# EAGLE design FunctionGen (EAGLE 6.4)
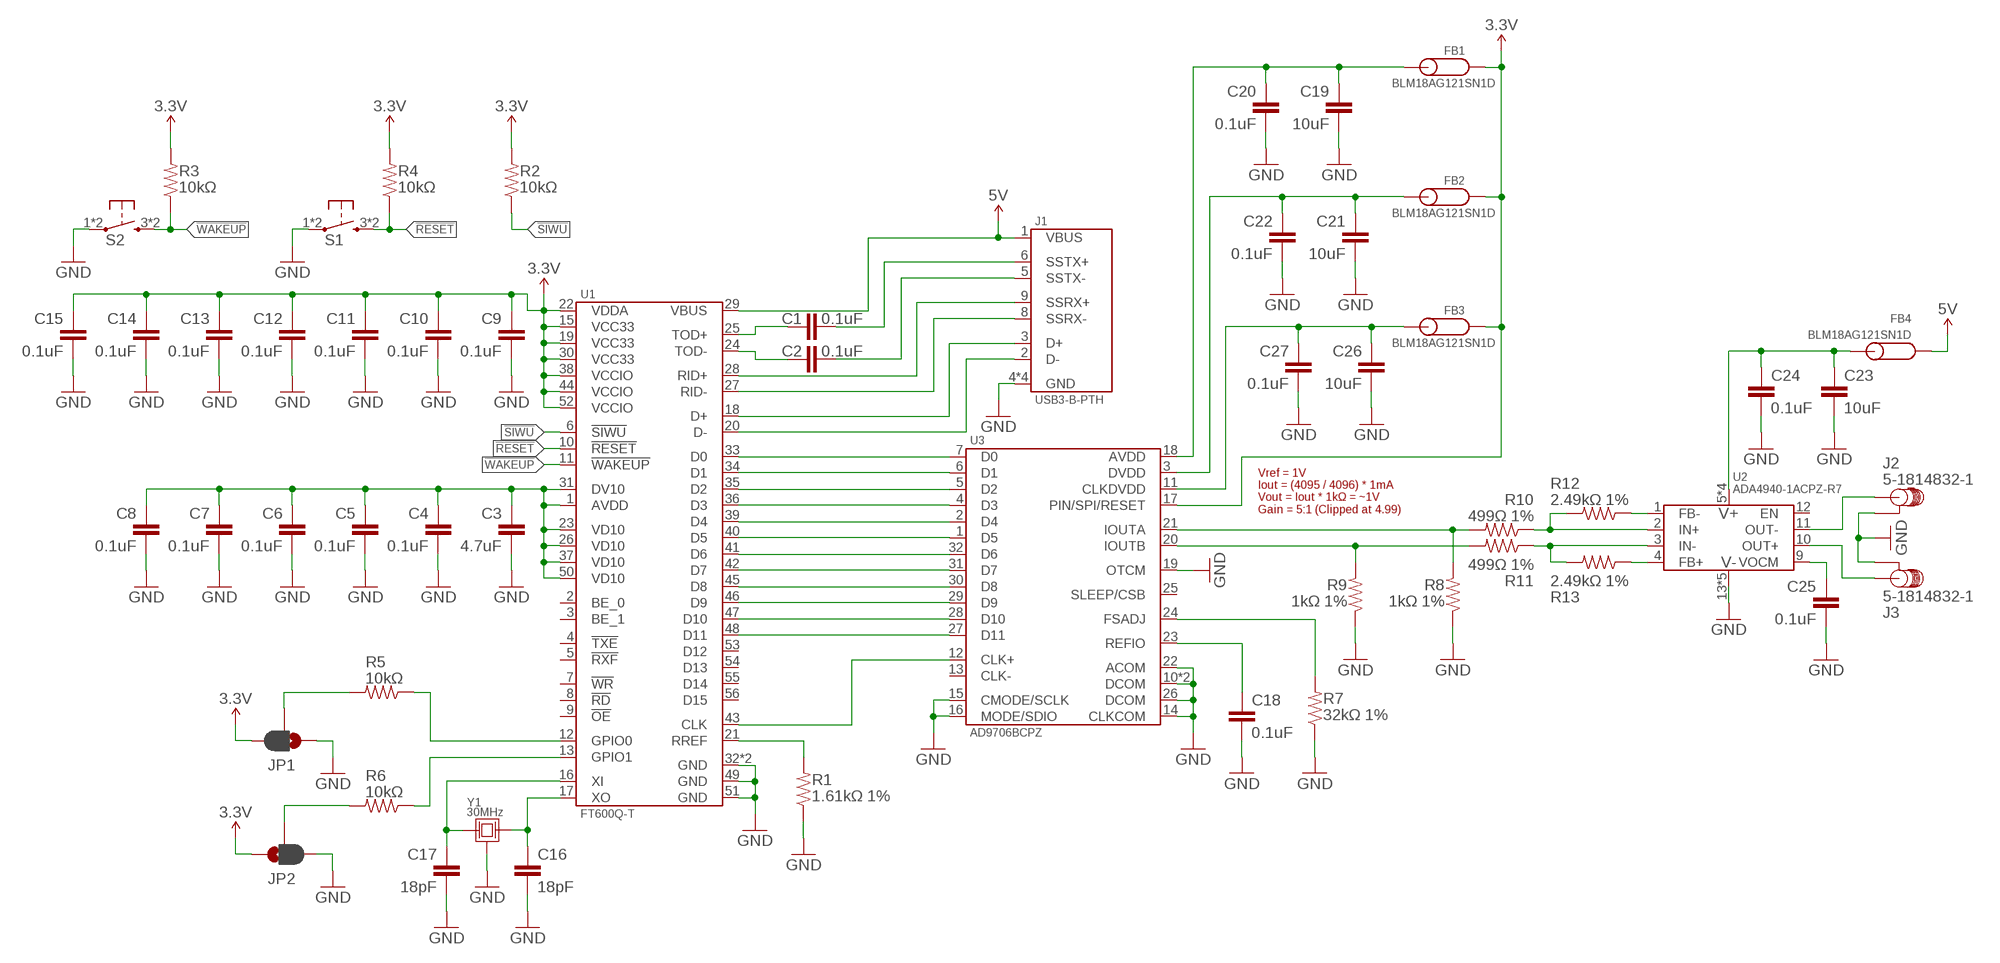
[diagram p0: schematic, sheet 1]

## Parts
C1  0.1uF  CAP-0603  [0603-CAP]
C2  0.1uF  CAP-0603  [0603-CAP]
C3  4.7uF  CAP-0603  [0603-CAP]
C4  0.1uF  CAP-0603  [0603-CAP]
C5  0.1uF  CAP-0603  [0603-CAP]
C6  0.1uF  CAP-0603  [0603-CAP]
C7  0.1uF  CAP-0603  [0603-CAP]
C8  0.1uF  CAP-0603  [0603-CAP]
C9  0.1uF  CAP-0603  [0603-CAP]
C10  0.1uF  CAP-0603  [0603-CAP]
C11  0.1uF  CAP-0603  [0603-CAP]
C12  0.1uF  CAP-0603  [0603-CAP]
C13  0.1uF  CAP-0603  [0603-CAP]
C14  0.1uF  CAP-0603  [0603-CAP]
C15  0.1uF  CAP-0603  [0603-CAP]
C16  18pF  CAP-0603  [0603-CAP]
C17  18pF  CAP-0603  [0603-CAP]
C18  0.1uF  CAP-0603  [0603-CAP]
C19  10uF  CAP-0603  [0603-CAP]
C20  0.1uF  CAP-0603  [0603-CAP]
C21  10uF  CAP-0603  [0603-CAP]
C22  0.1uF  CAP-0603  [0603-CAP]
C23  10uF  CAP-0603  [0603-CAP]
C24  0.1uF  CAP-0603  [0603-CAP]
C25  0.1uF  CAP-0603  [0603-CAP]
C26  10uF  CAP-0603  [0603-CAP]
C27  0.1uF  CAP-0603  [0603-CAP]
FB1  BLM18AG121SN1D  FERRITE-0603  [0603-FERRITE]
FB2  BLM18AG121SN1D  FERRITE-0603  [0603-FERRITE]
FB3  BLM18AG121SN1D  FERRITE-0603  [0603-FERRITE]
FB4  BLM18AG121SN1D  FERRITE-0603  [0603-FERRITE]
J1  USB3-B-PTH  [GSB4211311WEU]
J2  5-1814832-1  SMA-PTH  [SMA-PTH]
J3  5-1814832-1  SMA-PTH  [SMA-PTH]
JP1  JUMPER-PAD-3-2OF3_NC_BY_PASTE  [PAD-JUMPER-3-2OF3_NC_BY_PASTE_YES_SILK_FULL_BOX]
JP2  JUMPER-PAD-3-2OF3_NC_BY_PASTE  [PAD-JUMPER-3-2OF3_NC_BY_PASTE_YES_SILK_FULL_BOX]
R1  1.61kΩ 1%  RESISTOR-0603  [0603-CAP]
R2  10kΩ  RESISTOR-0603  [0603-CAP]
R3  10kΩ  RESISTOR-0603  [0603-CAP]
R4  10kΩ  RESISTOR-0603  [0603-CAP]
R5  10kΩ  RESISTOR-0603  [0603-CAP]
R6  10kΩ  RESISTOR-0603  [0603-CAP]
R7  32kΩ 1%  RESISTOR-0603  [0603-CAP]
R8  1kΩ 1%  RESISTOR-0603  [0603-CAP]
R9  1kΩ 1%  RESISTOR-0603  [0603-CAP]
R10  499Ω 1%  RESISTOR-0603  [0603-CAP]
R11  499Ω 1%  RESISTOR-0603  [0603-CAP]
R12  2.49kΩ 1%  RESISTOR-0603  [0603-CAP]
R13  2.49kΩ 1%  RESISTOR-0603  [0603-CAP]
S1  TACTILE-SMD3  [FSM4JSMA]
S2  TACTILE-SMD3  [FSM4JSMA]
U1  FT600Q-T  [VQFN-56-7MM]
U2  ADA4940-1ACPZ-R7  [VQFN-16-3MM]
U3  AD9706BCPZ  [VQFN-32-5MM]
Y1  30MHz  CRYSTAL-3.2X2.5  [FA-238]

## Nets
3.3V: C9.1 C10.1 C11.1 C12.1 C13.1 C14.1 C15.1 FB1.P$1 FB2.P$1 FB3.P$1 JP1.3 JP2.1 R2.2 R3.2 R4.2 U1.15(VCC33) U1.19(VCC33) U1.22(VDDA) U1.30(VCC33) U1.38(VCCIO) U1.44(VCCIO) U1.52(VCCIO) U3.17(PIN/SPI/RESET)
5V: FB4.P$1 J1.1(VBUS) U1.29(VBUS)
!RESET: R4.1 S1.3 S1.4 U1.10(!RESET)
!SIWU: R2.1 U1.6(!SIWU)
!WAKEUP: R3.1 S2.3 S2.4 U1.11(!WAKEUP)
_T_N: C2.1 U1.24(TOD-)
_T_P: C1.1 U1.25(TOD+)
CLK: U1.43(CLK) U3.12(CLK+)
D0: U1.33(D0) U3.7(D0)
D1: U1.34(D1) U3.6(D1)
D2: U1.35(D2) U3.5(D2)
D3: U1.36(D3) U3.4(D3)
D4: U1.39(D4) U3.2(D4)
D5: U1.40(D5) U3.1(D5)
D6: U1.41(D6) U3.32(D6)
D7: U1.42(D7) U3.31(D7)
D8: U1.45(D8) U3.30(D8)
D9: U1.46(D9) U3.29(D9)
D10: U1.47(D10) U3.28(D10)
D11: U1.48(D11) U3.27(D11)
D_N: J1.2(D-) U1.20(D-)
D_P: J1.3(D+) U1.18(D+)
GND: C3.2 C4.2 C5.2 C6.2 C7.2 C8.2 C9.2 C10.2 C11.2 C12.2 C13.2 C14.2 C15.2 C16.2 C17.2 C18.2 C19.2 C20.2 C21.2 C22.2 C23.2 C24.2 C25.2 C26.2 C27.2 J1.4(GND) J1.7(GND) J1.P$10(GND) J1.P$11(GND) J2.P$1(GND) J2.P$2(GND) J2.P$3(GND) J2.P$4(GND) J3.P$1(GND) J3.P$2(GND) J3.P$3(GND) J3.P$4(GND) JP1.1 JP2.3 R1.1 R7.1 R8.1 R9.1 S1.1 S1.2 S2.1 S2.2 U1.32(GND) U1.49(GND) U1.51(GND) U1.PAD(GND) U2.13(VS-) U2.14(VS-) U2.15(VS-) U2.16(VS-) U2.PAD(VS-) U3.10(DCOM) U3.14(CLKCOM) U3.15(CMODE/SCLK) U3.16(MODE/SDIO) U3.19(OTCM) U3.22(ACOM) U3.26(DCOM) U3.PAD(DCOM) Y1.2(GND) Y1.4(GND)
GPIO0: R5.1 U1.12(GPIO0)
GPIO1: R6.1 U1.13(GPIO1)
N$1: C3.1 C4.1 C5.1 C6.1 C7.1 C8.1 U1.1(AVDD) U1.23(VD10) U1.26(VD10) U1.31(DV10) U1.37(VD10) U1.50(VD10)
N$2: R1.2 U1.21(RREF)
N$3: C17.1 U1.16(XI) Y1.1
N$4: C16.1 U1.17(XO) Y1.3
N$5: JP1.2 R5.2
N$6: JP2.2 R6.2
N$22: C18.1 U3.23(REFIO)
N$23: R7.2 U3.24(FSADJ)
N$24: C19.1 C20.1 FB1.P$2 U3.18(AVDD)
N$25: C21.1 C22.1 FB2.P$2 U3.3(DVDD)
N$26: C26.1 C27.1 FB3.P$2 U3.11(CLKDVDD)
N$27: C23.1 C24.1 FB4.P$2 U2.5(VS+) U2.6(VS+) U2.7(VS+) U2.8(VS+)
N$28: C25.1 U2.9(VOCM)
N$29: R13.1 U2.4(FB+)
N$30: R12.1 U2.1(FB-)
N$31: R10.1 R12.2 U2.2(IN+)
N$32: R11.1 R13.2 U2.3(IN-)
N$33: R9.2 R11.2 U3.20(IOUTB)
N$34: R8.2 R10.2 U3.21(IOUTA)
N$35: J3.SIGNAL U2.10(OUT+)
N$36: J2.SIGNAL U2.11(OUT-)
R_N: J1.8(SSRX-) U1.27(RID-)
R_P: J1.9(SSRX+) U1.28(RID+)
T_N: C2.2 J1.5(SSTX-)
T_P: C1.2 J1.6(SSTX+)
Unconnected: U1.2(BE_0) U1.3(BE_1) U1.4(!TXE) U1.5(!RXF) U1.7(!WR) U1.8(!RD) U1.9(!OE) U1.53(D12) U1.54(D13) U1.55(D14) U1.56(D15) U2.12(EN) U3.13(CLK-) U3.25(SLEEP/CSB)

## Notes on the sheet
- Vref = 1V
  Iout = (4095 / 4096) * 1mA
  Vout = Iout * 1kΩ = ~1V
  Gain = 5:1 (Clipped at 4.99)

## Library data of the parts
C1-C27 = Passives:CAP
FB1-FB4 = Passives:FERRITE
J1 = Connectors:USB3
J2 J3 = Connectors:SMA
JP1 JP2 = SparkFun-Passives:JUMPER-PAD-3-2OF3_NC_BY_PASTE
R1-R13 = Passives:RESISTOR
S1 S2 = Passives:TACTILE
U1 = FTDI:FT600
U2 = AnalogDevices:ADA4940
U3 = AnalogDevices:AD9706
Y1 = Passives:CRYSTAL

## Board
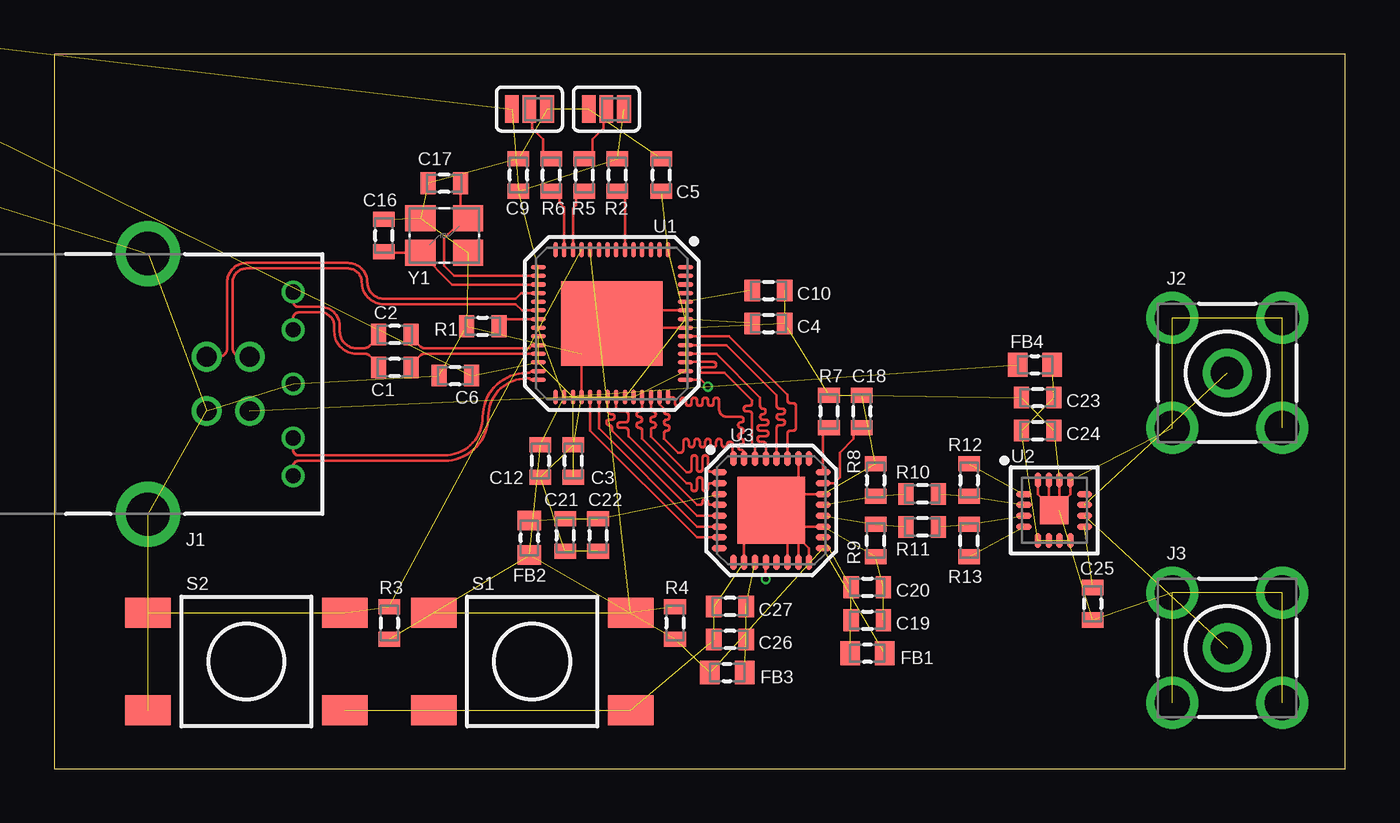
[diagram p1: board, top side]
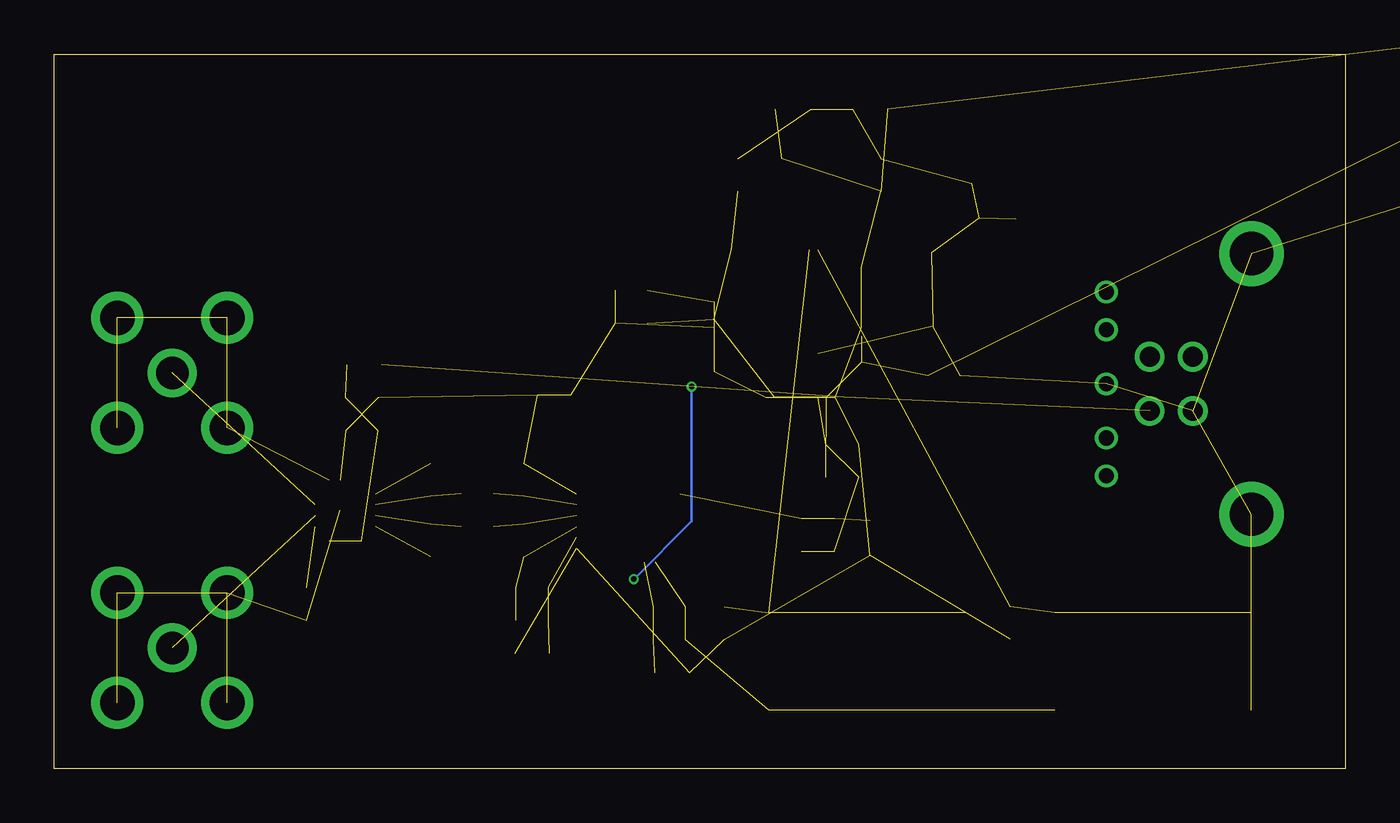
[diagram p2: board, bottom side, seen from below]

Size 59.69 x 33.02 mm. Coordinates in mm from the lower left corner, seen from the top.
Outline: 0,0 59.69,0 59.69,33.02 0,33.02 0,0
Copper layers (1*2*15*16): Top 0.035559375mm / dielectric 0.17018125mm / Route2 0.01778125mm / dielectric 47mil / Route15 0.01778125mm / dielectric 0.17018125mm / Bottom 0.035559375mm
Design rules "OSHPark-4layer *": minimum track width 5mil, minimum drill 10mil, track to track 5mil, track to pad 5mil, pad to pad 5mil, via to via 5mil, smd to smd 5mil, copper to edge 15mil, drill to drill 6mil, minimum pad ring 4mil, minimum via ring 4mil, stop-mask expansion 4mil, vias tented up to drill 20mil, thermal gap 10mil

### Footprints (pad centres in the part's own frame; a part is rotated, then mirrored left to right if it is on the bottom)
0603-CAP = smd 0.7 x 1: 1 -0.75,0; 2 0.75,0
0603-FERRITE = smd 0.9 x 1.1: P$1 -0.8,0; P$2 0.8,0
GSB4211311WEU = drill 0.92: 1 1.25,-2; 2 -1.25,-2; 3 -1.25,-4; 4 1.25,-4 | drill 0.7: 5 -4.25,0; 6 -2.5,0; 7 0,0; 8 2.5,0; 9 4.25,0 | drill 2: P$10 -6.02,-6.71; P$11 6.02,-6.71
SMA-PTH = drill 1.6: P$1 -2.54,2.54; P$2 -2.54,-2.54; P$3 2.54,-2.54; P$4 2.54,2.54 | drill 1.5: SIGNAL 0,0
PAD-JUMPER-3-2OF3_NC_BY_PASTE_YES_SILK_FULL_BOX = smd 0.635 x 1.27: 1 -0.813,0; 2 0,0; 3 0.813,0
FSM4JSMA = smd 2.1 x 1.4: 1 -4.55,-2.25; 2 4.55,-2.25; 3 -4.55,2.25; 4 4.55,2.25
VQFN-56-7MM = smd 0.7 x 0.2: 1 -3.4,2.6; 2 -3.4,2.2; 3 -3.4,1.8; 4 -3.4,1.4; 5 -3.4,1; 6 -3.4,0.6; 7 -3.4,0.2; 8 -3.4,-0.2; 9 -3.4,-0.6; 10 -3.4,-1; 11 -3.4,-1.4; 12 -3.4,-1.8; 13 -3.4,-2.2; 14 -3.4,-2.6; 29 3.4,-2.6; 30 3.4,-2.2; 31 3.4,-1.8; 32 3.4,-1.4; 33 3.4,-1; 34 3.4,-0.6; 35 3.4,-0.2; 36 3.4,0.2; 37 3.4,0.6; 38 3.4,1; 39 3.4,1.4; 40 3.4,1.8; 41 3.4,2.2; 42 3.4,2.6 | smd 0.2 x 0.7: 15 -2.6,-3.4; 16 -2.2,-3.4; 17 -1.8,-3.4; 18 -1.4,-3.4; 19 -1,-3.4; 20 -0.6,-3.4; 21 -0.2,-3.4; 22 0.2,-3.4; 23 0.6,-3.4; 24 1,-3.4; 25 1.4,-3.4; 26 1.8,-3.4; 27 2.2,-3.4; 28 2.6,-3.4; 43 2.6,3.4; 44 2.2,3.4; 45 1.8,3.4; 46 1.4,3.4; 47 1,3.4; 48 0.6,3.4; 49 0.2,3.4; 50 -0.2,3.4; 51 -0.6,3.4; 52 -1,3.4; 53 -1.4,3.4; 54 -1.8,3.4; 55 -2.2,3.4; 56 -2.6,3.4 | smd 3.9 x 4.7: PAD 0,0
VQFN-16-3MM = smd 0.7 x 0.3: 1 -1.4,0.75; 2 -1.4,0.25; 3 -1.4,-0.25; 4 -1.4,-0.75; 9 1.4,-0.75; 10 1.4,-0.25; 11 1.4,0.25; 12 1.4,0.75 | smd 0.3 x 0.7: 5 -0.75,-1.4; 6 -0.25,-1.4; 7 0.25,-1.4; 8 0.75,-1.4; 13 0.75,1.4; 14 0.25,1.4; 15 -0.25,1.4; 16 -0.75,1.4 | smd 1.3 x 1.3: PAD 0,0
VQFN-32-5MM = smd 0.7 x 0.3: 1 -2.4,1.75; 2 -2.4,1.25; 3 -2.4,0.75; 4 -2.4,0.25; 5 -2.4,-0.25; 6 -2.4,-0.75; 7 -2.4,-1.25; 8 -2.4,-1.75; 17 2.4,-1.75; 18 2.4,-1.25; 19 2.4,-0.75; 20 2.4,-0.25; 21 2.4,0.25; 22 2.4,0.75; 23 2.4,1.25; 24 2.4,1.75 | smd 0.3 x 0.7: 9 -1.75,-2.4; 10 -1.25,-2.4; 11 -0.75,-2.4; 12 -0.25,-2.4; 13 0.25,-2.4; 14 0.75,-2.4; 15 1.25,-2.4; 16 1.75,-2.4; 25 1.75,2.4; 26 1.25,2.4; 27 0.75,2.4; 28 0.25,2.4; 29 -0.25,2.4; 30 -0.75,2.4; 31 -1.25,2.4; 32 -1.75,2.4 | smd 3.1 x 3.1: PAD 0,0
FA-238 = smd 1.4 x 1.2: 1 -1.1,-0.8; 2 1.1,-0.8; 3 1.1,0.8; 4 -1.1,0.8

### Placement (x,y rotation side)
C1  15.75,18.54 180 top
C2  15.75,20.07 180 top
C3  24,14.22 90 top
C4  33.02,20.57 0 top
C5  28.07,27.43 90 top
C6  18.54,18.16 180 top
C7  -43.18,49.53 0 top  (outside the outline)
C8  -46.99,49.53 0 top  (outside the outline)
C9  21.46,27.43 90 top
C10  33.02,22.1 0 top
C11  -52.07,45.72 0 top  (outside the outline)
C12  22.48,14.22 270 top
C13  -41.91,38.1 0 top  (outside the outline)
C14  -46.99,38.1 0 top  (outside the outline)
C15  -52.07,38.1 0 top  (outside the outline)
C16  15.24,24.64 90 top
C17  18.03,27.05 180 top
C18  37.34,16.51 90 top
C19  37.59,6.86 0 top
C20  37.59,8.38 0 top
C21  23.62,10.79 270 top
C22  25.15,10.79 270 top
C23  45.47,17.14 180 top
C24  45.47,15.62 0 top
C25  48.01,7.62 270 top
C26  31.24,5.97 180 top
C27  31.24,7.49 180 top
FB1  37.59,5.33 180 top
FB2  21.97,10.67 90 top
FB3  31.11,4.45 0 top
FB4  45.34,18.67 0 top
J1  11.05,17.78 270 top
J2  54.23,18.29 0 top
J3  54.23,5.59 0 top
JP1  25.53,30.48 0 top
JP2  21.97,30.48 0 top
R1  19.81,20.45 0 top
R2  26.04,27.43 90 top
R3  15.49,6.73 270 top
R4  28.7,6.73 270 top
R5  24.51,27.43 90 top
R6  22.99,27.43 90 top
R7  35.81,16.51 270 top
R8  37.97,13.34 270 top
R9  37.97,10.54 90 top
R10  40.13,12.7 180 top
R11  40.13,11.18 180 top
R12  42.29,13.34 270 top
R13  42.29,10.54 90 top
S1  22.1,4.95 0 top
S2  8.89,4.95 0 top
U1  25.78,20.57 270 top
U2  46.23,11.94 0 top
U3  33.15,11.94 0 top
Y1  18.03,24.64 180 top

### Tracks (layer width: path | path; a pad name or v marks a point on that pad's centre or on a via)
3.3V  (22 unrouted)
5V  (2 unrouted)
!RESET  (3 unrouted)
!SIWU
  Top 0.127: U1.6 26.38,26.68 R2.1
!WAKEUP  (3 unrouted)
_T_N
  Top 0.127: U1.24 22.11,19.57 21.97,19.43 17.12,19.43 arc-45 16.94,19.5 16.5,19.95 C2.1
_T_P
  Top 0.127: U1.25 22.1,19.17 22.1,19.18 17.12,19.18 arc45 16.94,19.1 16.5,18.66 C1.1
CLK  (via drill 0.25)
  Top 0.127: U1.43 29.91,17.97 v30.23,17.65 | v32.89,8.76 U3.12
  Bottom 0.127: v32.89,8.76 30.23,11.43 v30.23,17.65
D0
  Top 0.127: U1.33 24.78,15.63 29.72,10.69 U3.7
D1
  Top 0.127: U1.34 25.18,15.72 29.72,11.19 U3.6
D2
  Top 0.127: U1.35 25.58,16.58 arc90 25.78,16.38 arc-90 25.91,16.26 arc-90 25.78,16.13 25.65,16.13 arc90 25.53,16 arc90 25.65,15.88 arc-90 25.78,15.75 25.78,15.62 29.71,11.69 U3.5
D3
  Top 0.127: U1.36 25.98,16.69 arc90 26.16,16.51 26.42,16.51 arc-90 26.54,16.38 26.54,16.13 arc-90 26.42,16 26.16,16 arc90 26.04,15.88 arc90 26.16,15.75 26.42,15.75 arc-90 26.54,15.62 26.54,15.36 29.72,12.19 29.84,12.19 arc90 29.97,12.32 arc-90 30.1,12.45 arc-90 30.23,12.32 arc90 30.35,12.19 U3.4
D4
  Top 0.127: 30.61,13.21 U3.2 30.33,13.19 arc90 30.23,13.08 30.23,12.95 arc-90 30.1,12.83 arc-90 29.97,12.95 29.97,13.34 arc90 29.84,13.46 arc90 29.72,13.34 29.72,12.95 arc-90 29.59,12.83 arc-90 29.46,12.95 29.46,13.08 arc90 29.36,13.19 29.23,13.19 27.18,15.24 27.18,15.62 arc90 27.05,15.75 arc-90 26.92,15.88 arc-90 27.05,16 arc90 27.18,16.13 arc90 27.05,16.26 arc-90 26.92,16.38 arc-90 27.05,16.51 arc90 27.18,16.64 U1.39
D5
  Top 0.127: U3.1 30.73,13.72 30.35,13.72 arc-90 30.23,13.84 30.23,14.35 arc90 30.1,14.48 arc90 29.97,14.35 29.97,13.84 arc-90 29.84,13.72 arc-90 29.72,13.84 29.72,14.35 arc90 29.59,14.48 arc90 29.46,14.35 29.46,13.84 arc-90 29.31,13.69 29.24,13.69 27.58,15.35 27.58,15.64 arc-90 27.69,15.75 arc90 27.81,15.88 arc90 27.69,16 arc-90 27.56,16.13 arc-90 27.69,16.26 arc90 27.81,16.38 arc90 27.69,16.51 arc-90 27.58,16.61 U1.40
D6
  Top 0.127: U1.41 27.98,16.85 28.19,16.64 28.19,16.51 arc90 28.32,16.38 arc-90 28.45,16.26 arc-90 28.32,16.13 arc90 28.19,16 arc90 28.32,15.88 arc-90 28.45,15.75 arc-90 28.32,15.62 arc90 28.19,15.49 28.19,15.24 28.83,14.61 28.96,14.61 arc90 29.08,14.73 29.08,15.11 arc-90 29.21,15.24 arc-90 29.34,15.11 29.34,14.99 arc90 29.46,14.86 arc90 29.59,14.99 29.59,15.11 arc-90 29.72,15.24 arc-90 29.84,15.11 29.84,14.99 arc90 29.97,14.86 arc90 30.1,14.99 30.1,15.11 arc-90 30.23,15.24 arc-90 30.35,15.11 30.35,14.99 arc90 30.48,14.86 arc90 30.61,14.99 30.61,15.11 arc-90 30.73,15.24 arc-90 30.86,15.11 30.86,14.99 arc90 30.99,14.86 arc90 31.11,14.99 arc-90 31.24,15.11 arc-90 31.37,14.99 31.37,14.37 U3.32
D7
  Top 0.127: U3.31 31.88,14.35 31.88,14.61 arc90 31.75,14.73 arc-90 31.62,14.86 arc-90 31.75,14.99 arc90 31.88,15.11 arc90 31.75,15.24 arc-90 31.62,15.37 arc-90 31.75,15.49 arc90 31.88,15.62 arc90 31.75,15.75 arc-90 31.62,15.88 arc-90 31.75,16 arc90 31.88,16.13 arc90 31.75,16.26 31.11,16.26 arc-90 30.73,16.64 30.73,17.02 arc90 30.61,17.14 arc90 30.48,17.02 30.48,16.89 arc-90 30.35,16.76 arc-90 30.23,16.89 30.23,17.02 arc90 30.1,17.14 arc90 29.97,17.02 29.97,16.89 arc-90 29.84,16.76 arc-90 29.72,16.89 29.72,17.02 arc90 29.59,17.14 arc90 29.46,17.02 29.46,16.89 arc-90 29.34,16.76 arc-90 29.21,16.89 29.21,17.02 arc90 29.08,17.14 arc90 28.96,17.02 28.96,16.89 arc-90 28.83,16.76 arc-90 28.7,16.89 28.7,17.02 arc90 28.55,17.17 U1.42
D8
  Top 0.127: U1.45 29.2,18.8 30.48,18.8 arc-90 30.61,18.67 arc-90 30.48,18.54 29.97,18.54 arc90 29.84,18.41 arc90 29.97,18.29 30.99,18.29 32.26,17.02 32.26,16.89 arc-90 32.13,16.76 32,16.76 arc90 31.88,16.64 arc90 32,16.51 32.13,16.51 arc-90 32.26,16.38 32.26,14.99 32.4,14.85 U3.30
D9
  Top 0.127: U1.46 30.61,19.17 32.64,17.15 32.64,16.76 arc90 32.77,16.64 arc-90 32.89,16.51 arc-90 32.77,16.38 arc90 32.64,16.26 arc90 32.77,16.13 32.89,16.13 arc-90 33.02,16 arc-90 32.89,15.88 32.64,15.88 arc90 32.51,15.75 arc90 32.64,15.62 32.89,15.62 arc-90 33.02,15.49 arc-90 32.89,15.37 32.64,15.37 arc90 32.51,15.24 arc90 32.64,15.11 32.77,15.11 arc-90 32.89,14.99 arc-90 32.9,14.98 U3.29
D10
  Top 0.127: U1.47 31.09,19.57 33.4,17.27 33.4,16.76 arc90 33.53,16.64 33.66,16.64 arc-90 33.78,16.51 arc-90 33.66,16.38 33.53,16.38 arc90 33.4,16.26 arc90 33.53,16.13 33.66,16.13 arc-90 33.78,16 arc-90 33.66,15.88 33.53,15.88 arc90 33.4,15.75 U3.28
D11
  Top 0.127: U1.48 31.2,19.97 33.9,17.27 33.9,17.03 arc90 34.04,16.89 34.16,16.89 arc-90 34.29,16.76 34.29,15.75 arc-90 34.16,15.62 34.04,15.62 arc90 33.9,15.48 U3.27
D_N
  Top 0.127: U1.20 21.62,21.17 21.34,21.46 15.24,21.46 arc-90 14.22,22.48 arc90 13.59,23.11 8.89,23.11 arc90 8.26,22.48 8.26,19.43 arc90 8.66,19.03 J1.2
D_P
  Top 0.127: U1.18 21.59,21.97 21.34,21.72 15.24,21.72 arc-90 14.48,22.48 arc90 13.59,23.37 8.89,23.37 arc90 8,22.48 8,19.43 arc-90 7.6,19.03 J1.3
GND  (51 unrouted)
  Top 0.127: U3.22 33.9,12.69 U3.PAD | U3.19 33.9,11.19 | U3.26 34.4,13.19 U3.PAD | U3.14 33.9,11.19 | 33.9,11.19 U3.PAD | U3.10 31.9,10.69 U3.PAD | U3.15 34.4,10.69 U3.PAD | U3.16 34.9,10.19 U3.PAD | U1.49 25.98,20.37 U1.PAD | U1.51 26.38,21.17 U1.PAD | U1.32 24.38,19.17 U1.PAD | U2.14 46.48,11.94 U2.PAD | U2.15 45.98,11.94 U2.PAD | U2.16 45.48,12.69 U2.PAD | U2.13 46.98,12.69 U2.PAD
GPIO0
  Top 0.127: U1.12 23.98,25.89 24.13,26.04 24.13,26.68 R5.1
GPIO1
  Top 0.127: U1.13 23.58,25.95 23.37,26.16 23.37,26.68 R6.1
N$1  (11 unrouted)
N$2
  Top 0.127: R1.2 20.56,20.77 U1.21
N$3
  Top 0.127: U1.16 18.5,22.77 18.03,23.24 18.03,24.51 18.96,25.44 Y1.1 18.78,25.79 C17.1
N$4
  Top 0.127: U1.17 18.4,22.37 Y1.3 15.29,23.84 C16.1
N$5
  Top 0.127: R5.2 24.78,28.45 24.89,28.45 24.89,29.08 25.4,29.59 25.4,30.35 JP1.2
N$6
  Top 0.127: R6.2 22.61,28.18 22.61,29.08 22.1,29.59 22.1,29.97 21.97,30.1 JP2.2
N$22
  Top 0.127: U3.23 36.05,13.19 36.32,13.46 36.32,14.61 36.96,15.24 36.96,15.76 C18.1
N$23
  Top 0.127: U3.24 35.55,15.49 R7.2
N$24  (3 unrouted)
N$25  (3 unrouted)
N$26  (3 unrouted)
N$27  (6 unrouted)
N$28  (1 unrouted)
N$29  (1 unrouted)
N$30  (1 unrouted)
N$31  (2 unrouted)
N$32  (2 unrouted)
N$33  (2 unrouted)
N$34  (2 unrouted)
N$35  (1 unrouted)
N$36  (1 unrouted)
R_N
  Top 0.127: U1.27 22.06,18.37 21.97,18.29 21.84,18.29 arc90 19.81,16.26 arc-90 18.03,14.48 11.3,14.48 arc-90 11.05,14.73 J1.8
R_P
  Top 0.127: U1.28 22.03,17.97 21.97,18.03 21.84,18.03 arc90 20.07,16.26 arc-90 18.03,14.22 11.3,14.22 arc90 11.05,13.97 J1.9
T_N
  Top 0.127: C2.2 15,19.95 14.59,19.54 arc-45 14.32,19.43 13.97,19.43 arc-90 13.21,20.19 13.21,20.45 arc90 12.32,21.34 11.3,21.34 arc-90 11.05,21.59 J1.5
T_P
  Top 0.127: C1.2 15,18.66 14.55,19.1 arc45 14.37,19.18 13.97,19.18 arc-90 12.95,20.19 12.95,20.45 arc90 12.32,21.08 11.3,21.08 arc90 11.05,20.83 J1.6